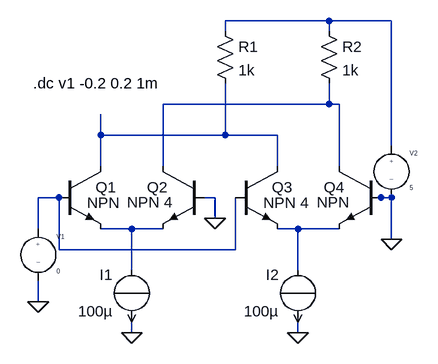
[diagram p0: schematic mult-1.asc]
mult-1.asc, the LTspice schematic file:
Version 4
SHEET 1 880 680
WIRE 496 -144 336 -144
WIRE 592 -144 496 -144
WIRE 336 -128 336 -144
WIRE 496 -128 496 -144
WIRE 496 -16 496 -48
WIRE 496 -16 240 -16
WIRE 512 -16 496 -16
WIRE 144 32 144 0
WIRE 336 32 336 -48
WIRE 336 32 144 32
WIRE 416 32 336 32
WIRE 592 48 592 -144
WIRE 144 80 144 32
WIRE 240 80 240 -16
WIRE 416 80 416 32
WIRE 512 80 512 -16
WIRE 80 128 48 128
WIRE 320 128 304 128
WIRE 576 128 560 128
WIRE 592 128 576 128
WIRE 320 160 320 128
WIRE 48 176 48 128
WIRE 192 176 144 176
WIRE 240 176 192 176
WIRE 448 176 416 176
WIRE 512 176 448 176
WIRE 592 192 592 128
WIRE 80 208 80 128
WIRE 352 208 352 128
WIRE 352 208 80 208
WIRE 192 240 192 176
WIRE 448 240 448 176
WIRE 48 288 48 256
WIRE 192 336 192 320
WIRE 448 336 448 320
FLAG 192 336 0
FLAG 592 192 0
FLAG 48 288 0
FLAG 320 160 0
FLAG 448 336 0
SYMBOL EIT_Semiconductors\\npn 80 80 R0
WINDOW 3 43 56 Left 2
SYMATTR InstName Q1
SYMBOL EIT_Semiconductors\\npn 304 80 M0
WINDOW 3 49 55 Left 2
SYMATTR InstName Q2
SYMATTR Value NPN 4
SYMBOL source-I 192 320 R180
WINDOW 0 29 73 Left 2
WINDOW 3 29 17 Left 2
WINDOW 123 0 0 Left 2
WINDOW 39 0 0 Left 2
SYMATTR InstName I1
SYMATTR Value 100µ
SYMBOL source-V 48 160 R0
SYMATTR InstName V1
SYMATTR Value 0
SYMBOL source-V 592 32 R0
SYMATTR InstName V2
SYMATTR Value 5
SYMBOL EIT_Semiconductors\\npn 352 80 R0
WINDOW 3 43 56 Left 2
SYMATTR InstName Q3
SYMATTR Value NPN 4
SYMBOL EIT_Semiconductors\\npn 576 80 M0
WINDOW 3 49 55 Left 2
SYMATTR InstName Q4
SYMBOL source-I 448 320 R180
WINDOW 0 29 73 Left 2
WINDOW 3 29 17 Left 2
WINDOW 123 0 0 Left 2
WINDOW 39 0 0 Left 2
SYMATTR InstName I2
SYMATTR Value 100µ
SYMBOL res 320 -144 R0
SYMATTR InstName R1
SYMATTR Value 1k
SYMBOL res 480 -144 R0
SYMATTR InstName R2
SYMATTR Value 1k
TEXT 40 -48 Left 2 !.dc v1 -0.2 0.2 1m

The netlist it stands for:
* mult-1.asc
Q1 N003 N004 N005 0 NPN
Q2 N002 0 N005 0 NPN 4
I1 N005 0 100µ
V1 N004 0 0
V2 N001 0 5
Q3 N003 N004 N006 0 NPN 4
Q4 N002 0 N006 0 NPN
I2 N006 0 100µ
R1 N001 N003 1k
R2 N001 N002 1k
.model NPN NPN
.model PNP PNP
.lib standard.bjt
.dc v1 -0.2 0.2 1m
.backanno
.end